# Altium schematic sheet Toplevel.SchDoc
size A4; SheetNumber: 1; SheetTotal: 5
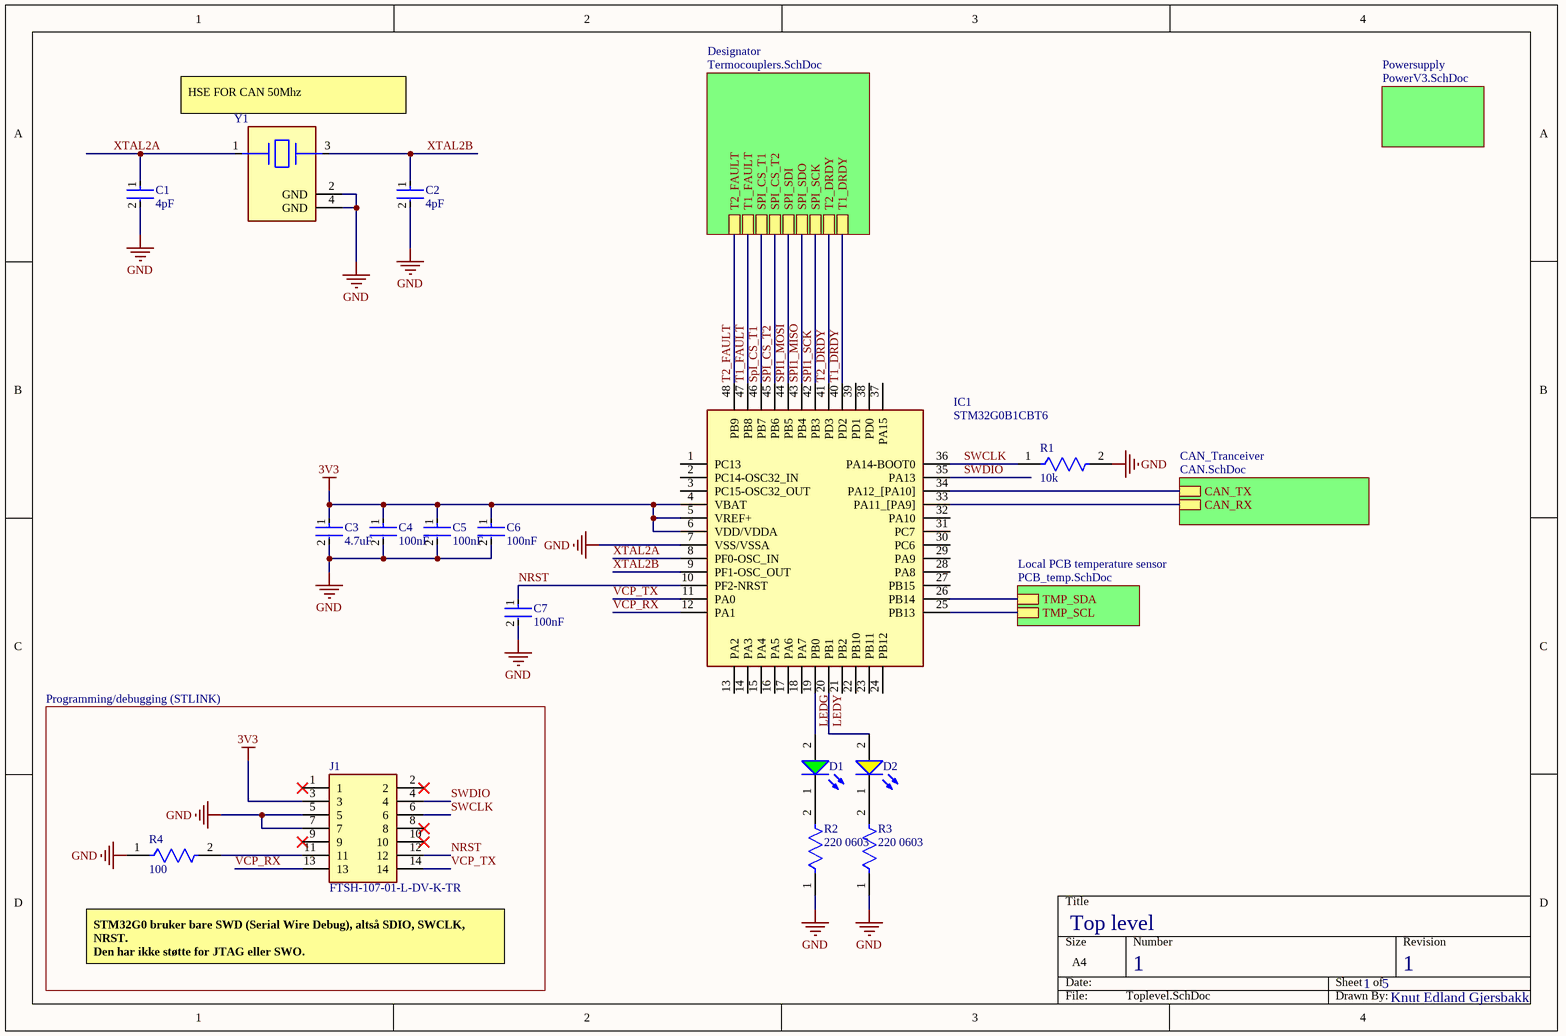
[diagram p0: Toplevel.SchDoc]

## Parts
C1  4pF  [FP-GQM187-0_15-IPC_B]
C2  4pF  [FP-GQM187-0_15-IPC_B]
C3  4.7uF  [FP-GCM21B-0_15-IPC_A]
C4  100nF  [FP-CL10-IPC_A]
C5  100nF  [FP-CL10-IPC_A]
C6  100nF  [FP-CL10-IPC_A]
C7  100nF  [FP-CL10-IPC_A]
D1  150060GS55040  [WL-SMCD_0603]  (value not drawn)
D2  150060YS75020  [WL-SMCW_0603_150060xx75020]  (value not drawn)
IC1  STM32G0B1CBT6  [QFP50P900X900X160-48N]
J1  FTSH-107-01-L-DV-K-TR  [FTSH10701LDVKTR]
R1  10k  [FP-RT0603-IPC_C]
R2  220 0603  [FP-AF0603-IPC_C]
R3  220 0603  [FP-AF0603-IPC_C]
R4  100  [FP-RT0603-MFG]
Y1  ABM10W-50.0000MHZ-4-B1U-T3  [FP-ABM10W-MFG]  (value not drawn)

## Blocks framed on the sheet
Programming/debugging (STLINK): J1 R4

## Sub-sheets
CAN_Tranceiver = CAN.SchDoc: CAN_TX, CAN_RX
Designator = Termocouplers.SchDoc: T1_FAULT, SPI_SDI, SPI_SDO, SPI_SCK, SPI_CS_T1, T2_DRDY, SPI_CS_T2, T2_FAULT, T1_DRDY
Local PCB temperature sensor = PCB_temp.SchDoc: TMP_SCL, TMP_SDA
Powersupply = PowerV3.SchDoc: no entries

## Nets
3V3: C3.1 C4.1 C5.1 C6.1 IC1.4(VBAT) IC1.5(VREF+) IC1.6(VDD/VDDA) J1.3
GND: C1.2 C2.2 C3.2 C4.2 C5.2 C6.2 C7.2 IC1.7(VSS/VSSA) J1.5 J1.7 R1.2 R2.1 R3.1 R4.1 Y1.2(GND) Y1.4(GND)
LEDG: D1.2(A) IC1.19(PB0)
LEDY: D2.2(A) IC1.20(PB1)
NRST: C7.1 IC1.10(PF2-NRST) J1.12
SPI1_MISO: IC1.43(PB4) ; sheet Designator/SPI_SDO
SPI1_MOSI: IC1.44(PB5) ; sheet Designator/SPI_SDI
SPI1_SCK: IC1.42(PB3) ; sheet Designator/SPI_SCK
SpI_CS_T1: IC1.46(PB7) ; sheet Designator/SPI_CS_T1
SPI_CS_T2: IC1.45(PB6) ; sheet Designator/SPI_CS_T2
SWCLK: IC1.36(PA14-BOOT0) J1.6 R1.1
SWDIO: IC1.35(PA13) J1.4
T1_DRDY: IC1.40(PD2) ; sheet Designator/T1_DRDY
T1_FAULT: IC1.47(PB8) ; sheet Designator/T1_FAULT
T2_DRDY: IC1.41(PD3) ; sheet Designator/T2_DRDY
T2_FAULT: IC1.48(PB9) ; sheet Designator/T2_FAULT
VCP_RX: IC1.12(PA1) J1.13
VCP_TX: IC1.11(PA0) J1.14
XTAL2A: C1.1 IC1.8(PF0-OSC_IN) Y1.1
XTAL2B: C2.1 IC1.9(PF1-OSC_OUT) Y1.3
NetD1_1: D1.1(K) R2.2
NetD2_1: D2.1(K) R3.2
NetIC1_25: IC1.25(PB13) ; sheet Local PCB temperature sensor/TMP_SCL
NetIC1_26: IC1.26(PB14) ; sheet Local PCB temperature sensor/TMP_SDA
NetIC1_33: IC1.33(PA11_[PA9]) ; sheet CAN_Tranceiver/CAN_RX
NetIC1_34: IC1.34(PA12_[PA10]) ; sheet CAN_Tranceiver/CAN_TX
NetJ1_11: J1.11 R4.2

Not connected (* = marked no-connect by the designer): IC1 1(PC13) 2(PC14-OSC32_IN) 3(PC15-OSC32_OUT) 13(PA2) 14(PA3) 15(PA4) 16(PA5) 17(PA6) 18(PA7) 21(PB2) 22(PB10) 23(PB11) 24(PB12) 27(PB15) 28(PA8) 29(PA9) 30(PC6) 31(PC7) 32(PA10) 37(PA15) 38(PD0) 39(PD1); J1 1* 2* 8* 9* 10*

## Notes on the sheet
- (near Y1) HSE FOR CAN 50Mhz
- Top level
- STM32G0 bruker bare SWD (Serial Wire Debug), altså SDIO, SWCLK, NRST.
  Den har ikke støtte for JTAG eller SWO.
- 1
- 5
- Knut Edland Gjersbakk

## Library data of the parts
C1 C2 = CMP-06035-061124-1: GQM1875C2E4R0BB12D / Ceramic Capacitor 4pF ±0.1pF 250VDC C0G 0603 Paper T/R; Voltage Rating: 250V; Thickness: 0.031inch; Packaging: Tape and Reel; Case Code (Metric): 1608; Series: GQM; Length: 1.6mm; Height: 0.7mm; Width: 0.8mm; Max Operating Temperature: 125°C; Case Code (Imperial): 0603; Capacitance: 4pF; Min Operating Temperature: -55°C; Construction: Flat; Package Quantity: 4000; Case/Package: 0603; Voltage Rating (DC): 250V; Mount: Surface Mount; Dielectric: C0G; Depth: 0.8mm; Termination: SMD/SMT; Radiation Hardening: No
C3 = CMP-2007-03343-2: Ceramic Capacitor for Automotive 4.7uF ±10% 16VDC X7R 0805 Embossed T/R; Voltage Rating (DC): 16V; Length: 2mm; Thickness: 0.055inch; Max Operating Temperature: 125°C; Min Operating Temperature: -55°C; Weight: 0.000335oz; Case Code (Imperial): 0805; REACH SVHC: No SVHC; Dielectric: X7R; Case/Package: 0805; Tolerance: 10%; Case Code (Metric): 2012; Lead Free: Lead Free; Depth: 1.25mm; Voltage Rating: 16V; Radiation Hardening: No; Termination: SMD/SMT; Mount: Surface Mount; Height: 1.25mm; Width: 0.049inch; Capacitance: 4.7uF; Packaging: Tape and Reel; Package Quantity: 1; Voltage: 16V; Ratings: AEC-Q200
C4-C7 = CMP-13271-002683-1: Cap Ceramic 100nF 16V X7R ±10% Pad SMD 0603 +125°C T/R; Voltage Rating: 16V; Max Operating Temperature: 125°C; Capacitance: 100nF; Features: Soft Termination; Length: 0.063inch; Packaging: Tape and Reel; Min Operating Temperature: -55°C; Mount: Surface Mount; Case/Package: 0603; Case Code (Metric): 1608; Width: 0.031inch; Ratings: AEC-Q200; Thickness: 0.035inch; Case Code (Imperial): 0603; Tolerance: 10%
D1 = CMP-03913-90235563-2: 150060GS55040 WL-SMCD SMT Mono-color Chip LED Diffused; Forward Voltage: 3.2V; Forward Current: 60mA; Luminous Intensity: 430mcd; Peak Wavelength: 520nm; Viewing Angle: 140°; Wavelength: 525nm; Max Reverse Voltage (DC): 5V; Max Operating Temperature: 85°C; Length: 1.6mm; Height: 400µm; Packaging: Tape and Reel; NexarPartId: 90235563; Dominant Wavelength: 525nm; Min Operating Temperature: -40°C; RoHS: Compliant; Width: 800µm
D2 = CMP-03913-104891429-2: WL-SMCW SMT Mono-Color Chip LED Waterclear super f; Forward Voltage: 2V; Forward Current: 60mA; Max Reverse Voltage (DC): 5V; Peak Wavelength: 595nm; Viewing Angle: 140°; Dominant Wavelength: 590nm; Luminous Intensity: 130mcd; Width: 800µm; RoHS: Compliant; Min Operating Temperature: -40°C; Max Operating Temperature: 85°C; Length: 1.6mm; Height: 250µm
IC1 = STM32G0B1CBT6: Integrated Circuit; Manufacturer_Name: STMicroelectronics; Datasheet Link: https://www.st.com/resource/en/datasheet/stm32g0b1cc.pdf; Height: 1.6mm; Manufacturer_Part_Number: STM32G0B1CBT6; Mouser Part Number: 511-STM32G0B1CBT6; Mouser Price/Stock: https://www.mouser.co.uk/ProductDetail/STMicroelectronics/STM32G0B1CBT6?qs=CiayqK2gdcKaQJ%2FcS3grXw%3D%3D; Arrow Part Number: STM32G0B1CBT6; Arrow Price/Stock: https://www.arrow.com/en/products/stm32g0b1cbt6/stmicroelectronics?utm_currency=USD&region=nac
J1 = FTSH-107-01-L-DV-K-TR: Connector; Manufacturer_Name: SAMTEC; Datasheet Link: https://suddendocs.samtec.com/prints/ftsh-1xx-xx-xxx-dv-xxx-xxx-x-xx-mkt.pdf?_gl=1*mdiyn1*_ga*MTcyMTUxMTIwMy4xNzEyMDQxMTc2*_ga_3KFNZC07WW*MTcxMjEzMDIxOS4yLjEuMTcxMjEzMDI1NC4yNS4wLjA.; Height: 6.25mm; Manufacturer_Part_Number: FTSH-107-01-L-DV-K-TR; Mouser Part Number: 200-FTSH10701LDVKTR; Mouser Price/Stock: https://www.mouser.co.uk/ProductDetail/Samtec/FTSH-107-01-L-DV-K-TR?qs=%252BZP6%2F%252BtExtDlh0wyxE013Q%3D%3D; Arrow Part Number: FTSH-107-01-L-DV-K-TR; Arrow Price/Stock: https://www.arrow.com/en/products/ftsh-107-01-l-dv-k-tr/samtec?utm_currency=USD&region=nac
R1 = CMP-03412-005349-1: RES SMD 10K OHM 1% 1/10W 0603 / RT0603FRE0710KL; Manufacturer: Yageo; Value: 10KΩ; Temperature Coefficient: 50 ppm/°C; Power Rating: 0.1W; Tolerance: 0.01; Voltage Rating: 75V; RoHS: TRUE; Category: Res; Automotive: No; Digikey Description: RES SMD 10K OHM 1% 1/10W 0603; ComponentLink2Description: Datasheet; Octopart: https://octopart.com/rt0603fre0710kl-yageo-40009243; ComponentLink2URL: http://www.yageo.com/documents/recent/PYu-RT_1-to-0.01_RoHS_L_9.pdf; Device Class L3: Chip SMD Resistors; Device Class L1: Passive Components; Temperature Range High: +155°C; Height: 0.55mm; Composition: Thin Film; Ipc Land Pattern Name: RESC16080X45; Series: RT; Package: RT0603; Resistance: 10KΩ; Footprint Url: http://www.yageo.com/exep/pages/download/literatures/PYu-R_Mount_10.pdf; Temperature: -55°C to +155°C; Temperature Range Low: -55°C; Lead Free: Yes; Device Class L2: Resistors; Mouser Description: Thin Film Resistors - SMD 10K ohm 1% 1/10W; Manufacturer Part Number: RT0603FRE0710KL
R2 R3 = CMP-03412-038529-1: AF0603JR-07220RL Anti-Sulfurated Chip Resistors Automotive Grade 220Ω 5% 100ppm/°C 0603; Max Power Dissipation: 100mW; Resistance: 220R; Width: 0.031inch; Case/Package: 0603; Series: AF; Features: Moisture Resistant; Tolerance: 5%; Resistor Type: Thick Film; Max Operating Temperature: 155°C; Length: 0.063inch; RoHS Compliant: Yes; Lead Free: Lead Free; Packaging: Tape and Reel; Number of Terminations: 2; Temperature Coefficient: 100ppm/°C; Height: 0.022inch; Min Operating Temperature: -55°C
R4 = CMP-03412-030646-1: RT0603 100Ω 0.1W 50 ppm/°C 1.00% RT0603FRE07100RL; Manufacturer: Yageo; Manufacturer Part Number: RT0603FRE10100RL; Tolerance: 0.01; Voltage Rating: 75V; Power Rating: 0.1W; Octopart: https://octopart.com/rt0603fre10100rl-yageo-22252409; Footprint Url: http://www.yageo.com/exep/pages/download/literatures/PYu-R_Mount_10.pdf; RoHS: TRUE; Temperature Range High: +155°C; Resistance: 100Ω; ComponentLink2Description: Datasheet; Device Class L1: Passive Components; Temperature Range Low: -55°C; Device Class L3: Chip SMD Resistors; Composition: Thin Film; Package: RT0603; Lead Free: Yes; Device Class L2: Resistors; Temperature: -55°C to +155°C; ComponentLink2URL: http://www.yageo.com/documents/recent/PYu-RT_1-to-0.01_RoHS_L_9.pdf; Value: 100Ω; Series: RT; Ipc Land Pattern Name: RESC16080X45; Automotive: No; Category: Res; Temperature Coefficient: 50 ppm/°C; Height: 0.55mm
Y1 = CMP-27762-007472-1: Crystal 50MHz ±10ppm 4pF SMD-4 2.5mm x 2mm; ESR (Equivalent Series Resistance): 70R; Frequency Tolerance: 10ppm; Mount: Surface Mount; Min Operating Temperature: -20°C; RoHS Compliant: Yes; Load Capacitance: 4pF; Frequency: 50MHz; Case/Package: SMD/SMT; Frequency Stability: 10ppm; Packaging: Tape and Reel; Max Operating Temperature: 70°C